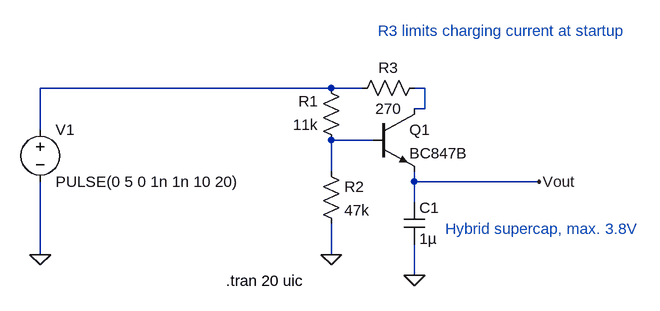
[diagram p0: schematic hybrid_cap.asc]
hybrid_cap.asc, the LTspice schematic file:
Version 4
SHEET 1 880 680
WIRE 208 48 -240 48
WIRE 256 48 208 48
WIRE 352 48 336 48
WIRE 352 80 352 48
WIRE 352 80 336 80
WIRE -240 112 -240 48
WIRE 272 128 208 128
WIRE 208 176 208 128
WIRE 336 192 336 176
WIRE 528 192 336 192
WIRE 336 224 336 192
WIRE -240 304 -240 192
WIRE 208 304 208 256
WIRE 336 336 336 288
FLAG 336 336 0
FLAG -240 304 0
FLAG 528 192 Vout
FLAG 208 304 0
SYMBOL voltage -240 96 R0
WINDOW 123 0 0 Left 0
WINDOW 39 0 0 Left 0
SYMATTR InstName V1
SYMATTR Value PULSE(0 5 0 1n 1n 10 20)
SYMBOL res 224 144 R180
WINDOW 0 36 76 Left 2
WINDOW 3 36 40 Left 2
SYMATTR InstName R1
SYMATTR Value 11k
SYMBOL npn 272 80 R0
SYMATTR InstName Q1
SYMATTR Value BC847B
SYMBOL cap 320 224 R0
SYMATTR InstName C1
SYMATTR Value 1µ
SYMBOL res 192 160 R0
SYMATTR InstName R2
SYMATTR Value 47k
SYMBOL res 352 32 R90
WINDOW 0 0 56 VBottom 2
WINDOW 3 32 56 VTop 2
SYMATTR InstName R3
SYMATTR Value 270
TEXT 46 344 Left 2 !.tran 20 uic
TEXT 384 264 Left 2 ;Hybrid supercap, max. 3.8V
TEXT 280 -40 Left 2 ;R3 limits charging current at startup

The netlist it stands for:
* hybrid_cap.asc
V1 N001 0 PULSE(0 5 0 1n 1n 10 20)
R1 N003 N001 11k
Q1 N002 N003 Vout 0 BC847B
C1 Vout 0 1µ
R2 N003 0 47k
R3 N002 N001 270
.model NPN NPN
.model PNP PNP
.lib standard.bjt
.tran 20 uic
* Hybrid supercap, max. 3.8V
* R3 limits charging current at startup
.backanno
.end